# Altium schematic sheet USB TO UART.SchDoc
size A3; SheetNumber: 1; SheetTotal: 1
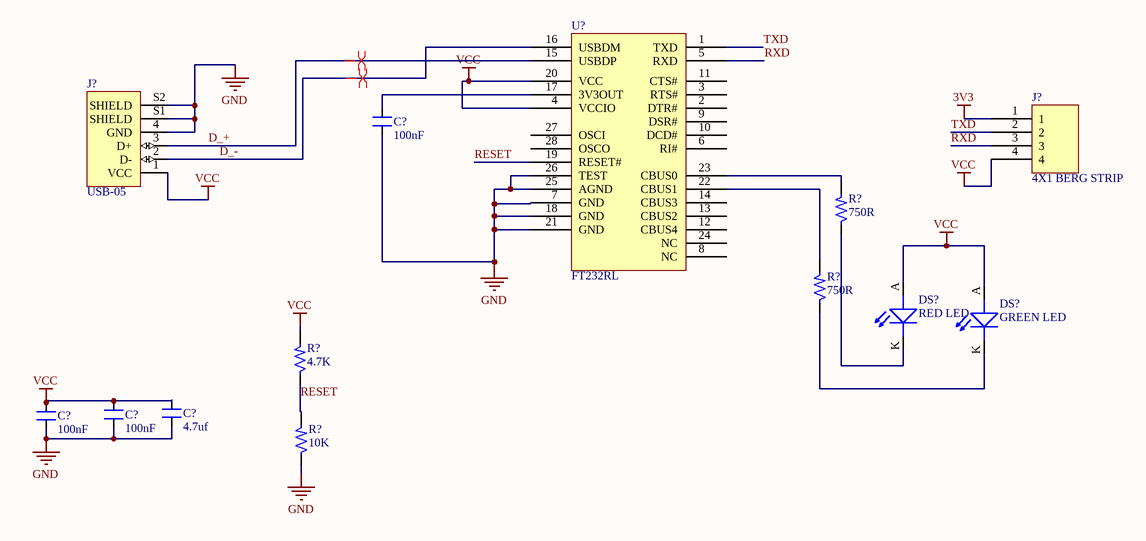
[diagram p0: USB TO UART.SchDoc]

## Parts
(Parts that share a designator on the sheet are numbered #1, #2 ... from top to bottom, then left to right.)
C?#1  100nF  [CAP_0805]
C?#2  100nF  [CAP_0805]
C?#3  100nF  [CAP_0805]
C?#4  4.7uf  [CAP_0805]
DS?#1  RED LED  [LED_0805]
DS?#2  GREEN LED  [LED_0805]
J?#1  USB-05  [USB2.0_TYPE-A_TH]
J?#2  4X1 BERG STRIP  [CON4_100_40D72_TH_ST_MALE]
R?#1  750R  [RES_0603]
R?#2  750R  [RES_0603]
R?#3  4.7K  [RES_0603]
R?#4  10K  [RES_0603]
U?  FT232RL  [TSSOP28_25.5_295_15X58_SMD]

## Nets
3V3: J?#2.1
GND: C?#1.1 C?#2.1 C?#3.1 C?#4.1 J?#1.4(GND) J?#1.S1(SHIELD) J?#1.S2(SHIELD) R?#4.1 U?.7(GND) U?.18(GND) U?.21(GND) U?.25(AGND) U?.26(TEST)
VCC: C?#2.2 C?#3.2 C?#4.2 DS?#1.A(ANODE) DS?#2.A(ANODE) J?#1.1(VCC) J?#2.4 R?#3.2 U?.4(VCCIO) U?.20(VCC)
D_+: J?#1.3(D+) U?.15(USBDP)
D_-: J?#1.2(D-) U?.16(USBDM)
RESET: R?#3.1 R?#4.2 U?.19(RESET#)
RXD: J?#2.3 U?.5(RXD)
TXD: J?#2.2 U?.1(TXD)
NetC?#1_2: C?#1.2 U?.17(3V3OUT)
NetDS?#1_K: DS?#1.K(CATHODE) R?#1.1
NetDS?#2_K: DS?#2.K(CATHODE) R?#2.1
NetR?#1_2: R?#1.2 U?.23(CBUS0)
NetR?#2_2: R?#2.2 U?.22(CBUS1)

Not connected (* = marked no-connect by the designer): U? 2(DTR#) 3(RTS#) 6(RI#) 8(NC) 9(DSR#) 10(DCD#) 11(CTS#) 12(CBUS4) 13(CBUS2) 14(CBUS3) 24(NC) 27(OSCI) 28(OSCO)

## Layout directives
differential pair; net class *; differential pair class DIFFPAIR: D_+, D_-

## Library data of the parts
C?#1-C?#4 = CAP_100pF-50V-5%-0805: 100pF ±5% 50V Ceramic Capacitor C0G, NP0 0805 (2012 Metric); Manufacturer: KEMET; Manufacturer Part Number: CC0805JRNPO9BN101; Alternate Part Number-1: NA; Case/Package: 0805; Supplier-1: SIRICOM; Supplier Part Number-1: 0805N101J500LT
DS?#1 = LED_RED-2V-20mA-0805: Red 631nm LED Indication - Discrete 2V 0805 (2012 Metric); Manufacturer: Vishay Lite-On; Manufacturer Part Number: LTST-C171KRKT; Alternate Part Number-1: NA; Case/Package: 0805; Supplier-1: SP ROAD; Supplier Part Number-1: LTST-C171KRKT
DS?#2 = LED_GREEN-2.2-20mA-0805: Green 569nm LED Indication - Discrete 2.1V 0805 (2012 Metric); Manufacturer: Vishay Lite-On; Manufacturer Part Number: LTST-C171GKT; Alternate Part Number-1: NA; Case/Package: 0805; Supplier-1: SP ROAD; Supplier Part Number-1: LTST-C171GKT
J?#1 = CON-PLG_USB-TYPE-A-TH: USB Connectors USB CONN PLUG RA SMT POST 1.1 REEL; Manufacturer: TE Connectivity; Alternate Part Number-1: NA; Manufacturer Part Number: USB-05; Case/Package: TH; Supplier-1: LCSC; Supplier Part Number-1: C112454
J?#2 = CON-BS-PLG_4X1-100-ST-TH: 4 Pins, 1 Row 2.54mm Pitch, Straight bergstrip, Male; Manufacturer: NA; Manufacturer Part Number: NA; Case/Package: TH-CON; Supplier-1: SP ROAD; Supplier Part Number-1: NA; Alternate Part Number-1: NA
R?#1 R?#2 = RES_750R-0.1W-1%-0603: 750 ±1% 0.1W, 1/10W Chip Resistor 0603 (1608 Metric) Moisture Resistant Thick Film; Manufacturer Part Number: CR0603-FX-7500ELF; Manufacturer: Bourns Inc.; Alternate Part Number: NA; Case/Package: 0603; Supplier-1: Digikey; Supplier Part Number-1: CR0603-FX-7500ELFCT-ND - Cut Tape (CT)
R?#3 = RES_4.7K-0.1W-1%-0603: 4.7 kOhms ±1% 0.1W, 1/10W Chip Resistor 0603 (1608 Metric) Moisture Resistant Thick Film; Manufacturer: Walsin; Manufacturer Part Number: WR06X4701FTL; Alternate Part Number-1: MR06X4701FTL; Case/Package: 0603; Supplier-1: SIRICOM; Supplier Part Number-1: WR06X4701FTL
R?#4 = RES_10K-0.1W-1%-0603: 10 kOhms ±1% 0.1W, 1/10W Chip Resistor 0603 (1608 Metric) Automotive AEC-Q200 Thick Film; Manufacturer: Walsin; Manufacturer Part Number: WR06X1002FTL; Alternate Part Number-1: 0603WAJ0103T5E; Case/Package: 0603; Supplier-1: SIRICOM; Supplier Part Number-1: WR06X1002FTL
U? = IC_FT232RL: USB Bridge, USB to UART USB 2.0 UART Interface 28-SSOP; Manufacturer: FTDI; Alternate Part Number-1: NA; Manufacturer Part Number: FT232RL; Case/Package: TSSOP28; Supplier-1: Aliepress; Supplier Part Number-1: FT232RL